# EAGLE design SiegeLeanControl (EAGLE 9.5.2)
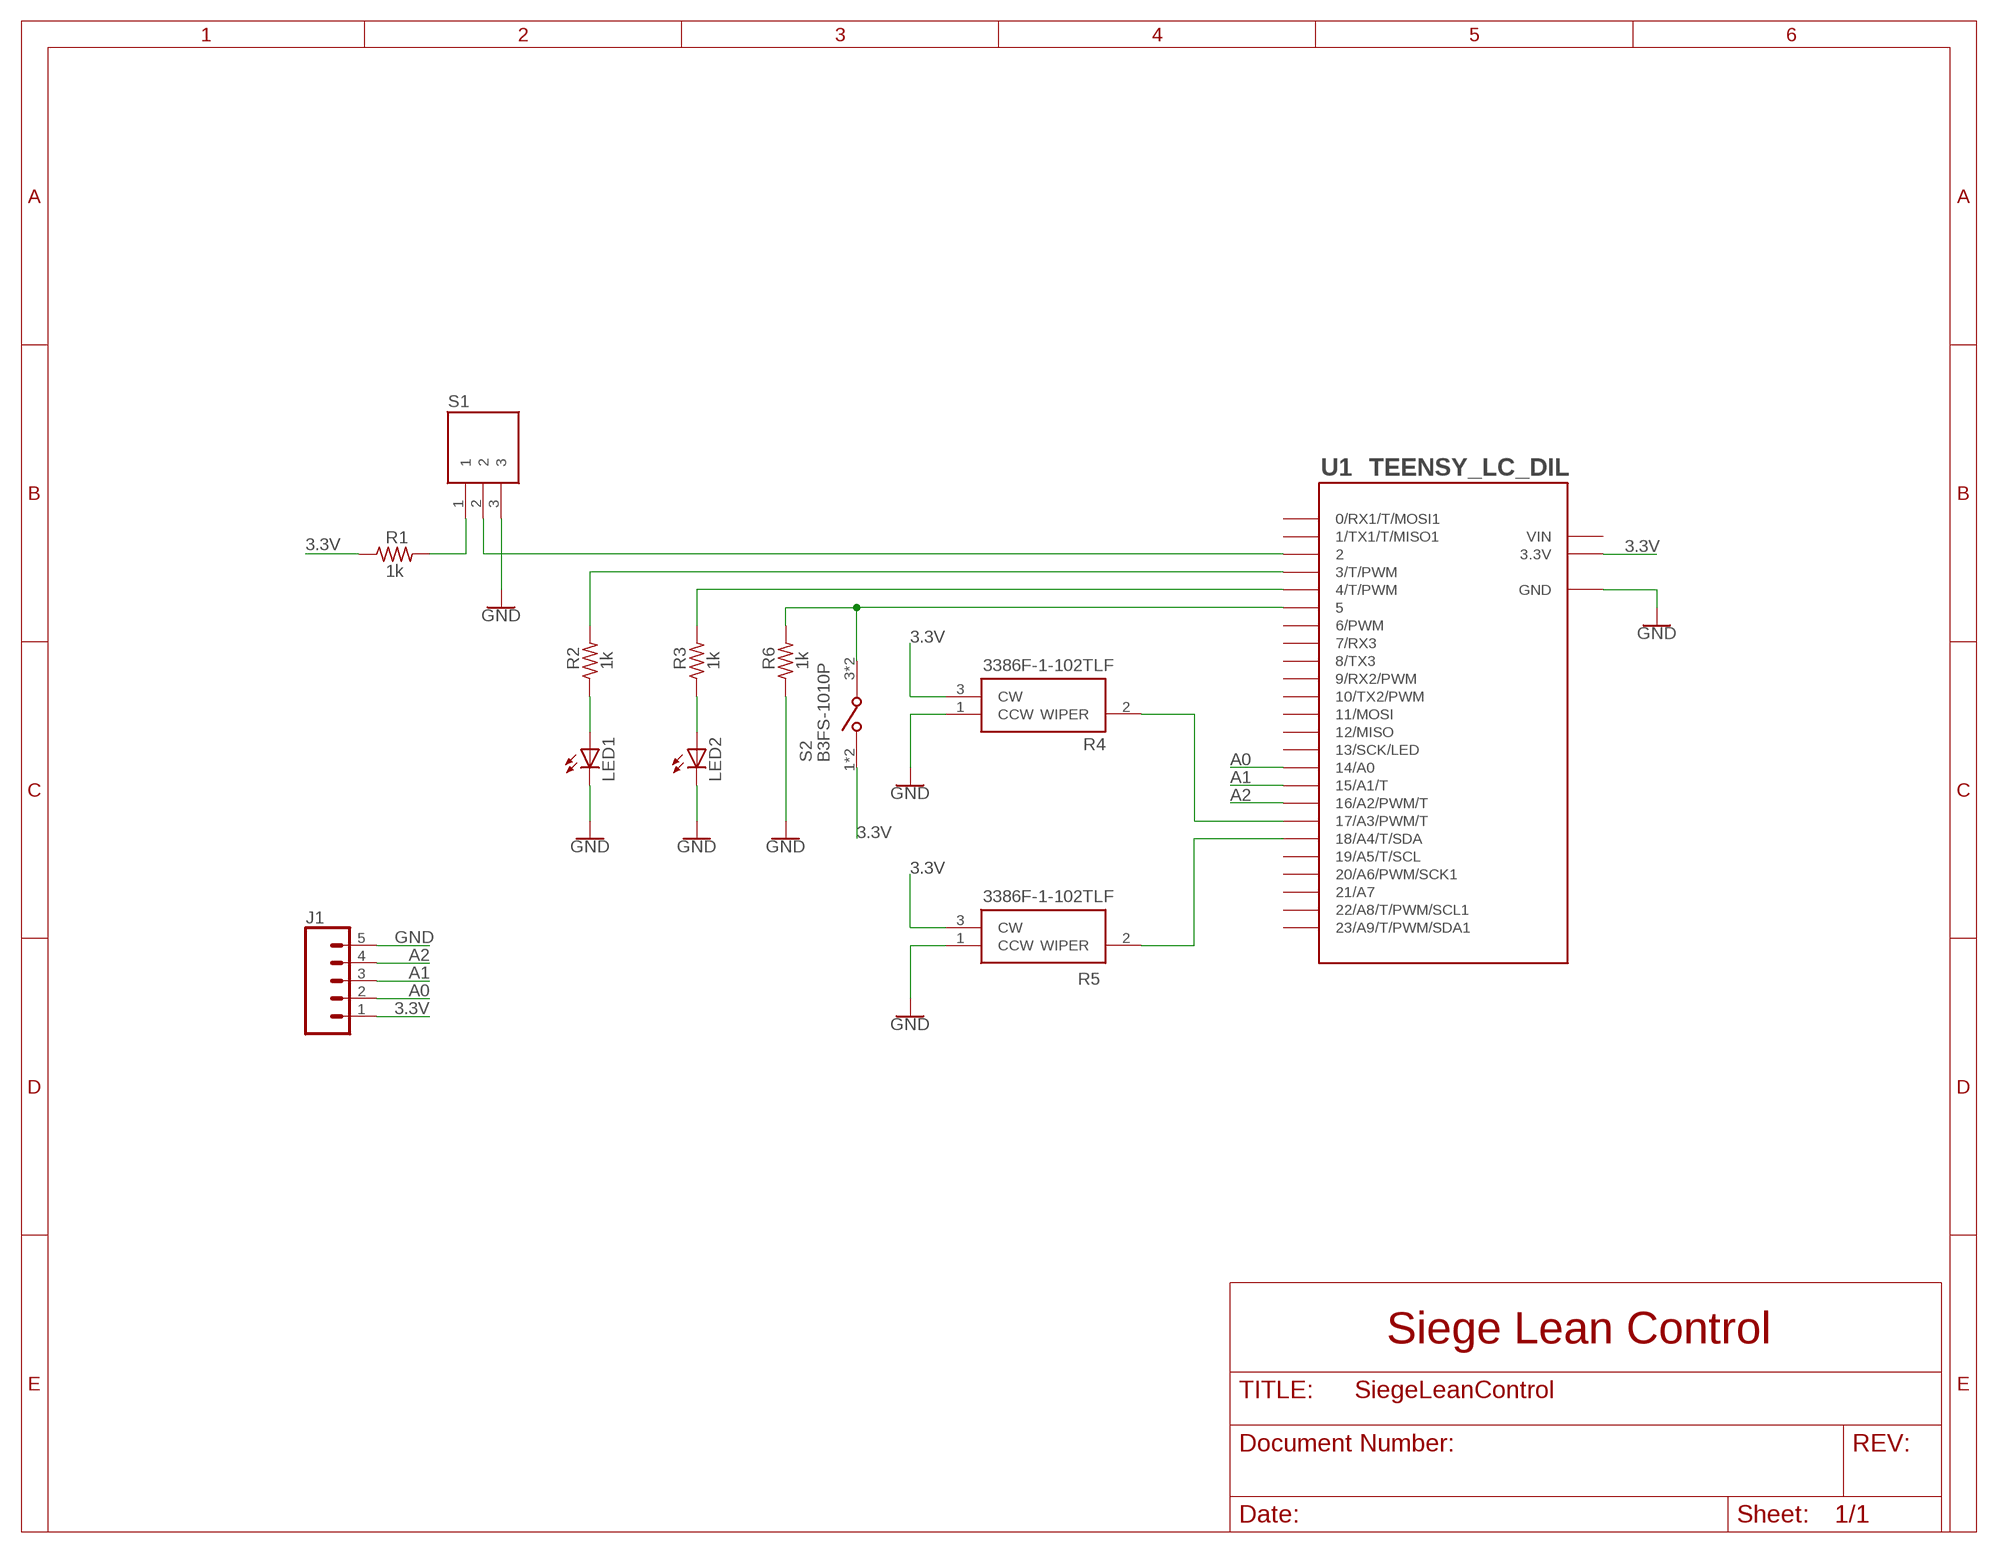
[diagram p0: schematic, sheet 1]

## Parts
J1  CONN_05  [1X05]
LED1  LEDCHIPLED_1206  [CHIPLED_1206]
LED2  LEDCHIPLED_1206  [CHIPLED_1206]
R1  1k  R-US_R1206  [R1206]
R2  1k  R-US_R1206  [R1206]
R3  1k  R-US_R1206  [R1206]
R4  3386F-1-103TLF  [3386F1103TLF]
R5  3386F-1-103TLF  [3386F1103TLF]
R6  1k  R-US_R1206  [R1206]
S1  OS102011MA1QN1  [OS102011MA1QN1]
S2  B3FS-1010P  [SW_B3FS-1010P]
U1  TEENSY_LC_DIL  [TEENSY_3.0-3.2&LC_DIL]

## Nets
3.3V: J1.1 R1.1 R4.3(CW) R5.3(CW) S2.1 S2.2 U1.3.3V
A0: J1.2 U1.14/A0
A1: J1.3 U1.15/A1(15/A1/T)
A2: J1.4 U1.16/A2(16/A2/PWM/T)
GND: J1.5 LED1.C LED2.C R4.1(CCW) R5.1(CCW) R6.1 S1.3 U1.AGND(GND) U1.GND
N$1: S1.2 U1.2
N$2: R1.2 S1.1
N$3: R2.2 U1.3(3/T/PWM)
N$4: R3.2 U1.4(4/T/PWM)
N$5: LED1.A R2.1
N$6: LED2.A R3.1
N$7: R4.2(WIPER) U1.17/A3(17/A3/PWM/T)
N$8: R6.2 S2.3 S2.4 U1.5
N$9: R5.2(WIPER) U1.18/A4(18/A4/T/SDA)
Unconnected: U1.0(0/RX1/T/MOSI1) U1.1(1/TX1/T/MISO1) U1.6(6/PWM) U1.7(7/RX3) U1.8(8/TX3) U1.9(9/RX2/PWM) U1.10(10/TX2/PWM) U1.11(11/MOSI) U1.12(12/MISO) U1.13(13/SCK/LED) U1.19/A5(19/A5/T/SCL) U1.20/A6(20/A6/PWM/SCK1) U1.21/A7 U1.22/A8(22/A8/T/PWM/SCL1) U1.23/A9(23/A9/T/PWM/SDA1)

## Notes on the sheet
- 3386F-1-102TLF
- 3386F-1-102TLF

## Power pins joined to a net without a drawn wire
VIN: U1.VIN

## Library data of the parts
J1 = SparkFun-Connectors:CONN_05: Multi connection point. Often used as Generic Header-pin footprint for 0.1 inch spaced/style header connections On any of the 0.1 inch spaced packages, you can populate with these: Break Away Headers - Straight <https://www.sparkfun.com/products/116> (PRT-00116) Break Away Male Headers - Right Angle <https://www.sparkfun.com/products/553> (PRT-00553) Female Headers <https://www.sparkfun.com/products/115> (PRT-00115) Break Away Headers - Machine Pin <https://www.sparkfun.com/products/117> (PRT-00117) Break Away Female Headers - Swiss Machine Pin <https://www.sparkfun.com/products/743> (PRT-00743) For SCREWTERMINALS and SPRING TERMINALS visit here: Screw Terimnals on SparkFun.com <https://www.sparkfun.com/search/results?term=Screw+Terminals> (5mm/3.5mm/2.54mm spacing) This device is also useful as a general connection point to wire up your design to another part of your project. Our various solder wires solder well into these plated through hole pads. Hook-Up Wire - Assortment (Stranded, 22 AWG) <https://www.sparkfun.com/products/11375> (PRT-11375) Hook-Up Wire - Assortment (Solid Core, 22 AWG) <https://www.sparkfun.com/products/11367> (PRT-11367) View the entire wire category on our website here <https://www.sparkfun.com/categories/141> Special notes: Molex polarized connector foot print use with SKU : PRT-08231 with associated crimp pins and housings. 1MM SMD Version SKU: PRT-10208
LED1 LED2 = adafruit:LED: LED OSRAM: - CHIPLED LG R971, LG N971, LY N971, LG Q971, LY Q971, LO R971, LY R971 LH N974, LH R974 LS Q976, LO Q976, LY Q976 LO Q996 - Hyper CHIPLED LW Q18S LB Q993, LB Q99A, LB R99A - SideLED LS A670, LO A670, LY A670, LG A670, LP A670 LB A673, LV A673, LT A673, LW A673 LH A674 LY A675 LS A676, LA A676, LO A676, LY A676, LW A676 LS A679, LY A679, LG A679 - Hyper Micro SIDELED® LS Y876, LA Y876, LO Y876, LY Y876 LT Y87S - SmartLED LW L88C, LW L88S LB L89C, LB L89S, LG L890 LS L89K, LO L89K, LY L89K LS L896, LA L896, LO L896, LY L896 - TOPLED LS T670, LO T670, LY T670, LG T670, LP T670 LSG T670, LSP T670, LSY T670, LOP T670, LYG T670 LG T671, LOG T671, LSG T671 LB T673, LV T673, LT T673, LW T673 LH T674 LS T676, LA T676, LO T676, LY T676, LB T676, LH T676, LSB T676, LW T676 LB T67C, LV T67C, LT T67C, LS T67K, LO T67K, LY T67K, LW E67C LS E67B, LA E67B, LO E67B, LY E67B, LB E67C, LV E67C, LT E67C LW T67C LS T679, LY T679, LG T679 LS T770, LO T770, LY T770, LG T770, LP T770 LB T773, LV T773, LT T773, LW T773 LH T774 LS E675, LA E675, LY E675, LS T675 LS T776, LA T776, LO T776, LY T776, LB T776 LHGB T686 LT T68C, LB T68C - Hyper Mini TOPLED® LB M676 - Mini TOPLED Santana® LG M470 LS M47K, LO M47K, LY M47K Source: http://www.osram.convergy.de/
R1-R3 R6 = adafruit:R-US_: RESISTOR, American symbol
R4 R5 = !SiegeLeanControl:3386F-1-103TLF: Bourns 3386F Series Through Hole Cermet Trimmer Resistor with Pin Terminations, 10k +/-10% 1/2W +/-100ppm/C Finger Adjust Source: Datasheet <https://componentsearchengine.com/Datasheets/1/3386F-1-103TLF.pdf>; ALLIED_NUMBER: 70407773; ALLIED_PRICE-STOCK: https://www.alliedelec.com/bourns-3386f-1-103tlf/70407773/; DESCRIPTION: Bourns 3386F Series Through Hole Cermet Trimmer Resistor with Pin Terminations, 10k +/-10% 1/2W +/-100ppm/C Finger Adjust; HEIGHT: 4.83mm; MANUFACTURER_NAME: Bourns; MANUFACTURER_PART_NUMBER: 3386F-1-103TLF; MOUSER_PART_NUMBER: 652-3386F-1-103TLF; MOUSER_PRICE-STOCK: https://www.mouser.com/Search/Refine.aspx?Keyword=652-3386F-1-103TLF; RS_PART_NUMBER: 5222233P; RS_PRICE-STOCK: http://uk.rs-online.com/web/p/products/5222233P
S1 = !FlashingHeart:OS102011MA1QN1: Switch Slide Right Angle SPDT 0.1A 12VDC Through Hole Slide Switch SPDT On-On 0.1 A@ 12 V dc Slide Source: Datasheet <http://www.ckswitches.com/media/1428/os.pdf>; ALLIED_NUMBER: 70128246; ALLIED_PRICE-STOCK: https://www.alliedelec.com/c-k-os102011ma1qn1/70128246/; DESCRIPTION: Switch Slide Right Angle SPDT 0.1A 12VDC Through Hole Slide Switch SPDT On-On 0.1 A@ 12 V dc Slide; HEIGHT: mm; MANUFACTURER_NAME: C & K COMPONENTS; MANUFACTURER_PART_NUMBER: OS102011MA1QN1; MOUSER_PART_NUMBER: 611-OS102011MA1QN1; MOUSER_PRICE-STOCK: https://www.mouser.com/Search/Refine.aspx?Keyword=611-OS102011MA1QN1; RS_PART_NUMBER: 7874855; RS_PRICE-STOCK: http://uk.rs-online.com/web/p/products/7874855
S2 = !SiegeLeanControl:B3FS-1010P: Switch Tactile N.O. SPST Flat Plunger Gull Wing 0.05A 24VDC 0.98N SMD Embossed T/R; DESCRIPTION: Tactile Switch SPST-NO Top Actuated Surface Mount; DIGI-KEY_PART_NUMBER: SW1440CT-ND; DIGI-KEY_PURCHASE_URL: https://www.digikey.com/product-detail/en/omron-electronics-inc-emc-div/B3FS-1010P/SW1440CT-ND/2764639?utm_source=snapeda&utm_medium=aggregator&utm_campaign=symbol; MF: Omron Electronics; MP: B3FS-1010P; PACKAGE: None
U1 = Teensy_3_and_LC_Series_Boards_v1.4:TEENSY_LC_DIL

## Board
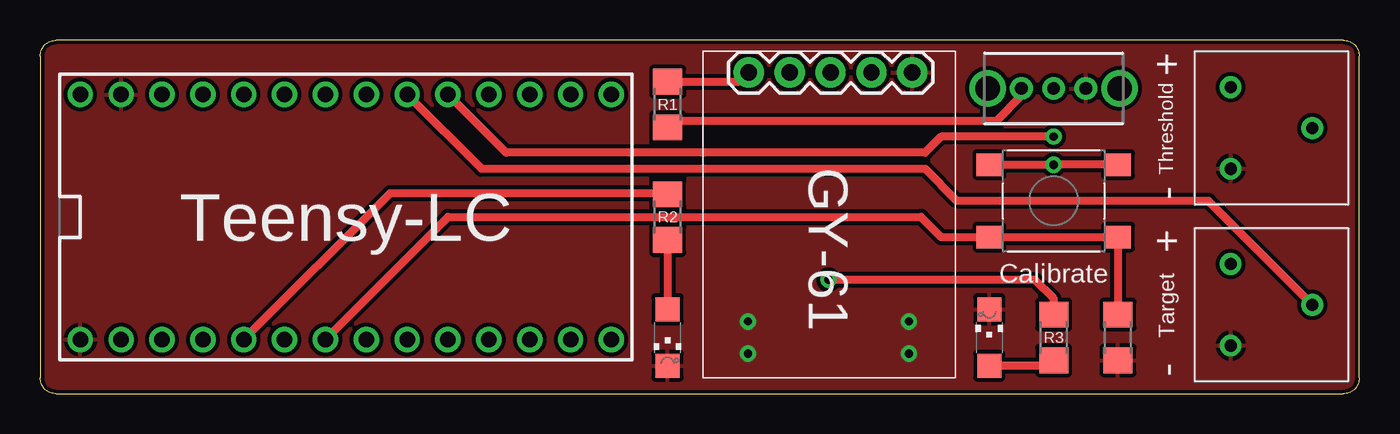
[diagram p1: board, top side]
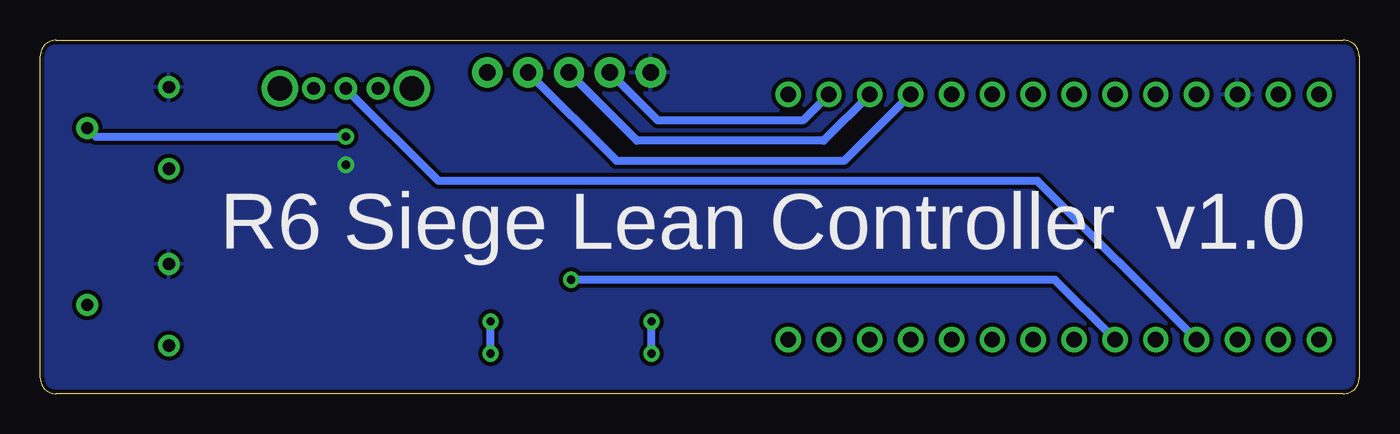
[diagram p2: board, bottom side, seen from below]

Size 82 x 22 mm. Coordinates in mm from the lower left corner, seen from the top.
Outline: 0,21 0,1 arc90 1,0 81,0 arc90 82,1 82,21 arc90 81,22 1,22 arc90 0,21
Copper layers (1*16): Top 0.035mm / dielectric 1.5mm / Bottom 0.035mm
Design rules "SparkFun": minimum track width 8mil, minimum drill 20mil, track to track 8mil, track to pad 8mil, pad to pad 8mil, via to via 8mil, smd to smd 8mil, copper to edge 8mil, drill to drill 8mil, minimum pad ring 12mil, minimum via ring 10mil, stop-mask expansion 4mil, vias tented up to drill 20mil, thermal gap 10mil

### Footprints (pad centres in the part's own frame; a part is rotated, then mirrored left to right if it is on the bottom)
1X05 = drill 1.016 pad 1.88: 1 0,0; 2 2.54,0; 3 5.08,0; 4 7.62,0; 5 10.16,0
CHIPLED_1206 = smd 1.5 x 1.5: A 0,-1.75; C 0,1.75
R1206 = smd 1.6 x 1.803: 1 -1.422,0; 2 1.422,0
3386F1103TLF = drill 0.75 pad 1.2: 1 0,0; 2 2.54,-5.08; 3 5.08,0
OS102011MA1QN1 = drill 0.8 pad 1.3: 1 -2,0; 2 0,0; 3 2,0 | drill 1.5 pad 2.25: 4 -4.1,0; 5 4.1,0
SW_B3FS-1010P = smd 1.6 x 1.4: 1 -4,2.25; 2 4,2.25; 3 -4,-2.25; 4 4,-2.25
TEENSY_3.0-3.2&LC_DIL = drill 0.965: 0 -7.62,13.97; 1 -7.62,11.43; 2 -7.62,8.89; 3 -7.62,6.35; 3.3V 7.62,11.43; 4 -7.62,3.81; 5 -7.62,1.27; 6 -7.62,-1.27; 7 -7.62,-3.81; 8 -7.62,-6.35; 9 -7.62,-8.89; 10 -7.62,-11.43; 11 -7.62,-13.97; 12 -7.62,-16.51; 13 7.62,-16.51; 14/A0 7.62,-13.97; 15/A1 7.62,-11.43; 16/A2 7.62,-8.89; 17/A3 7.62,-6.35; 18/A4 7.62,-3.81; 19/A5 7.62,-1.27; 20/A6 7.62,1.27; 21/A7 7.62,3.81; 22/A8 7.62,6.35; 23/A9 7.62,8.89; AGND 7.62,13.97; GND -7.62,16.51; VIN 7.62,16.51

### Placement (x,y rotation side)
J1  44.05,19.99 0 top
LED1  39,3.5 180 top
LED2  59,3.5 0 top
R1  39,18 270 top
R2  39,11 90 top
R3  63,3.5 90 top
R4  74,14 90 top
R5  74,3 90 top
R6  67,3.5 90 top
S1  63,19 0 top
S2  63,12 0 top
U1  19,11 90 top

### Tracks (layer width: path | path; a pad name or v marks a point on that pad's centre or on a via)
3.3V  (via drill 0.51)
  Top 0.5: R1.1 43.48,19.42 J1.1 | 67.33,13.92 S2.2 v63,14.25 S2.1
  pour Bottom (isolate 0.25): 0,0 0,22 82,22 82,0
A0
  Bottom 0.5: U1.14/A0 34.59,17 43.6,17 J1.2
A1
  Bottom 0.5: U1.15/A1 33.3,15.75 44.9,15.75 J1.3
A2
  Bottom 0.5: J1.4 46.18,14.5 32.01,14.5 U1.16/A2
GND  (via drill 0.51)
  Bottom 0.5: v54,2.5 v54,4.5 | v44,2.5 v44,4.5
  pour Top (isolate 0.25): 0,0 0,22 82,22 82,0
N$1
  Bottom 0.5: S1.2 57.25,13.25 20,13.25 10.13,3.38 U1.2
N$2
  Top 0.5: R1.2 39.4,16.98 59.43,16.98 61,18.55 S1.1
N$3
  Top 0.5: R2.2 38.95,12.47 21.74,12.47 U1.3
N$4  (via drill 0.51)
  Top 0.5: R3.2 63,5.92 61.82,7.1 v49,7.1
  Bottom 0.5: U1.4 18.91,7.1 v49,7.1
N$5
  Top 0.5: R2.1 LED1.A
N$6
  Top 0.5: R3.1 62.67,1.75 LED2.A
N$7  (via drill 0.51)
  Top 0.5: U1.17/A3 28.97,15 55,15 56,16 v63,16
  Bottom 0.5: R4.2 78.53,15.99 v63.01,15.99 v63,16
N$8
  Top 0.5: U1.5 25.35,11 54.75,11 56,9.75 S2.3 S2.4 R6.2
N$9
  Top 0.5: U1.18/A4 27.43,14 55,14 57,12 72.62,12 R5.2

### Text on the board
tPlace: + | Threshold | - | + | Calibrate | Target | -
tNames: Teensy-LC | GY-61
bNames: v1.0 | R6 Siege Lean Controller